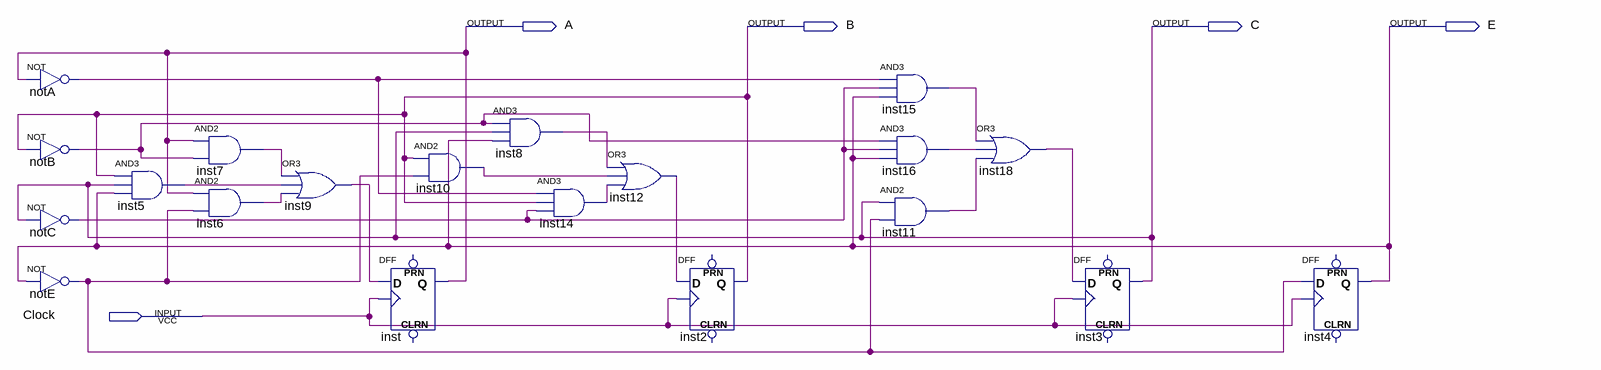
[diagram p0: schematic sheet]
// Quartus schematic Proj.bdf as structural Verilog: 20 symbols, 5 pins
module Proj (
  input  Clock,
  output A,
  output B,
  output C,
  output E
);

  wire inst5_out, inst6_out, inst7_out, inst8_out, inst9_out, inst10_out, inst11_out, inst12_out, inst14_out,
       inst15_out, inst16_out, inst18_out, notA_out, notB_out, notC_out, notE_out;

  not notA (notA_out, A);
  not notB (notB_out, B);
  not notC (notC_out, C);
  not notE (notE_out, E);
  and inst5 (inst5_out, B, C, E);
  and inst7 (inst7_out, A, notB_out);
  and inst6 (inst6_out, A, notE_out);
  or inst9 (inst9_out, inst7_out, inst5_out, inst6_out);
  DFF inst (.CLK(Clock), .D(inst9_out), .Q(A));  // open: CLRN, PRN
  and inst10 (inst10_out, B, notE_out);
  and inst8 (inst8_out, notB_out, C, E);
  and inst14 (inst14_out, notA_out, B, notC_out);
  or inst12 (inst12_out, inst8_out, inst10_out, inst14_out);
  DFF inst2 (.CLK(Clock), .D(inst12_out), .Q(B));  // open: CLRN, PRN
  and inst15 (inst15_out, notA_out, notC_out, E);
  and inst16 (inst16_out, notB_out, notC_out, E);
  and inst11 (inst11_out, C, notE_out);
  or inst18 (inst18_out, inst15_out, inst16_out, inst11_out);
  DFF inst3 (.CLK(Clock), .D(inst18_out), .Q(C));  // open: CLRN, PRN
  DFF inst4 (.CLK(Clock), .D(notE_out), .Q(E));  // open: CLRN, PRN
endmodule
